# Altium schematic sheet BMD_RevB_B1_BD.SchDoc: Block Diagram
size 401 x 291 mm; DocumentNumber: 3; SheetNumber: 1; SheetTotal: 6
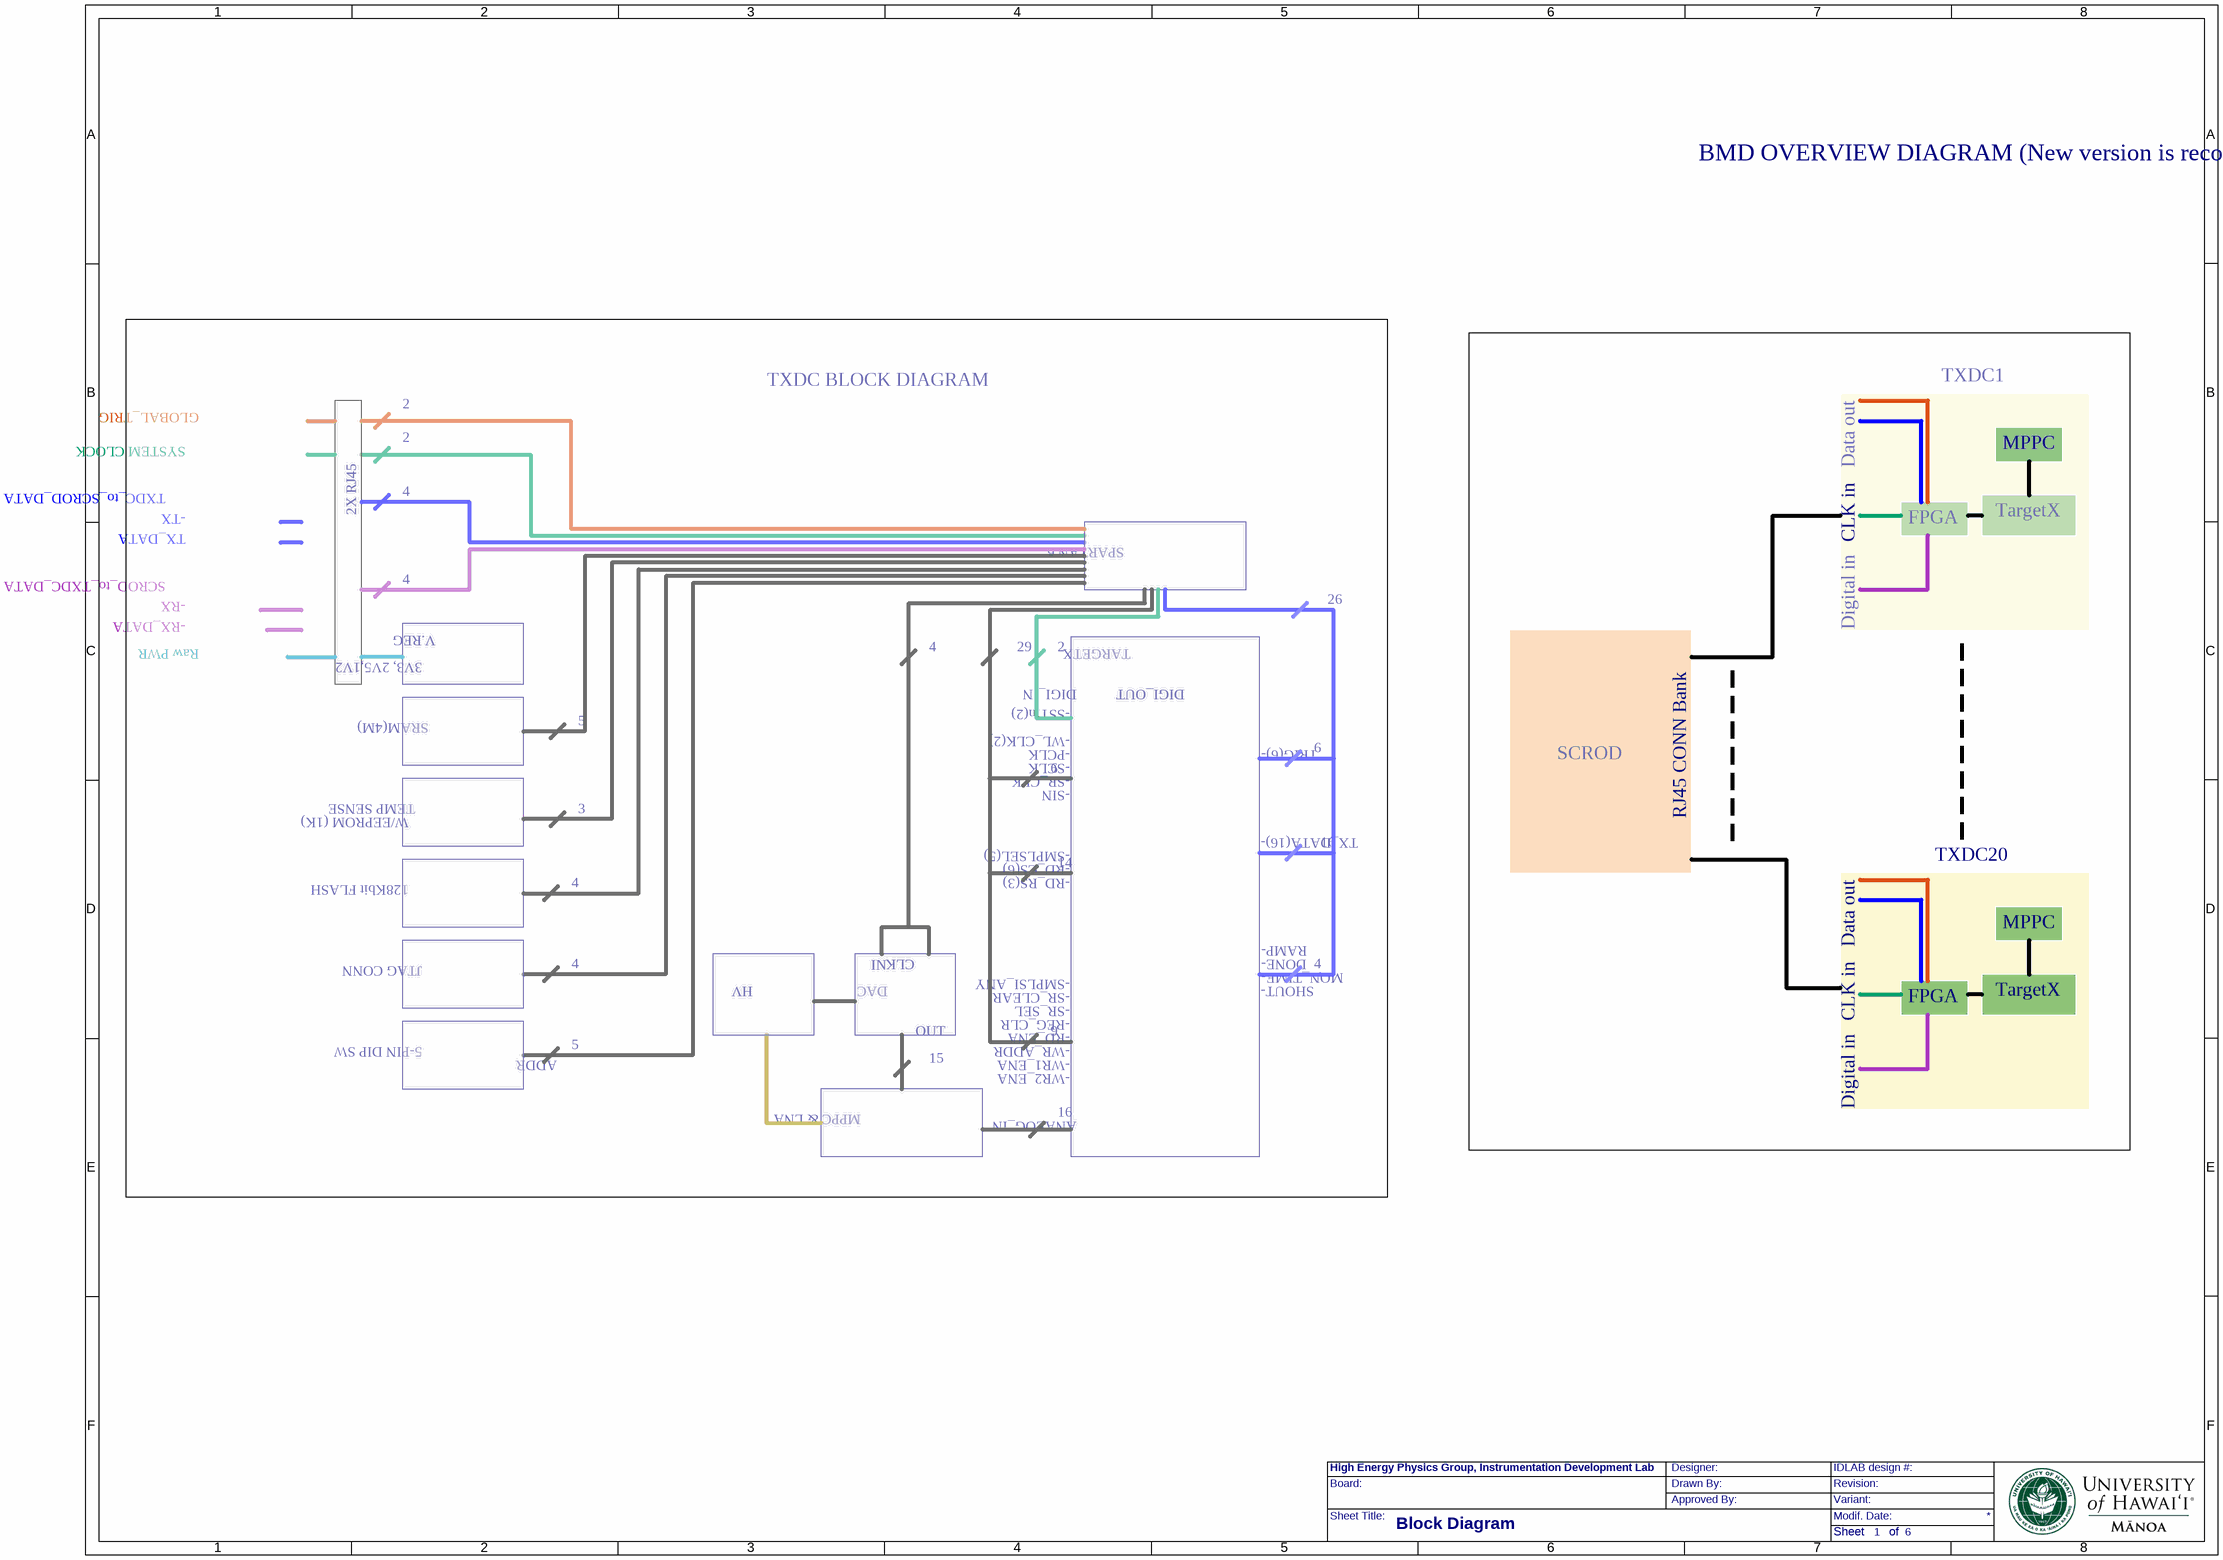
[diagram p0: BMD_RevB_B1_BD.SchDoc]

## Notes on the sheet
- BMD OVERVIEW DIAGRAM (New version is reconfigured for the tracker planes on the HMB)
- TXDC BLOCK DIAGRAM
- GLOBAL_TRIG
- 2
- TXDC1
- TXDC_to_SCROD_DATA
- SYSTEM CLOCK
- 4
- Data out
- MPPC
- -TX
- TX_DATA
- 2X RJ45
- SPARTAN 6
- CLK in
- FPGA
- TargetX
- SCROD_to_TXDC_DATA
- -RX
- -RX_DATA
- 29
- 26
- Digital in
- Raw PWR
- 3V3, 2V5,1V2
- V.REG
- DIGI_IN
- TARGETX
- DIGI_OUT
- SRAM(4M)
- 5
- 6
- -WL_CLK(2)
- -SSTin(2)
- -PCLK
- -SCLK
- TRIG(6)-
- SCROD
- W/EEPROM (1K)
- TEMP SENSE
- 3
- -SR_CLK
- -SIN
- 16
- RJ45 CONN Bank
- 128Kbit FLASH
- 14
- -SMPLSEL(5)
- -RD_CS(6)
- -RD_RS(3)
- TX_DATA(16)-
- TXDC20
- IN
- CLK
- RAMP-
- DONE-
- JTAG CONN
- HV
- DAC
- OUT
- 15
- 9
- -SMPLSI_ANY
- -SR_CLEAR
- -SR_SEL
- -REG_CLR
- -RD_ENA
- MON_TIME-
- SHOUT-
- 5-PIN DIP SW
- ADDR
- -WR_ADDR
- -WR1_ENA
- -WR2_ENA
- MPPC & LNA
- ANALOG_IN
- Board:
- High Energy Physics Group, Instrumentation Development Lab
- Drawn By:
- Designer:
- Approved By:
- Revision:
- IDLAB design #:
- Variant:
- Sheet Title:
- Modif. Date:
- Sheet       of